# Altium schematic sheet Sheet1.SchDoc
size A4
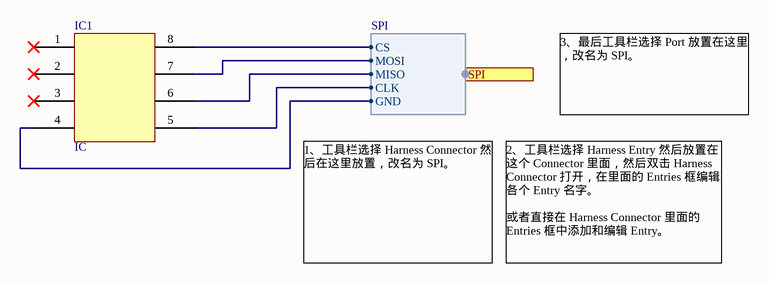
[diagram p0: Sheet1.SchDoc]

## Parts
IC1  IC  [SOP8_N]

## Ports
SPI (harness SPI)

## Harnesses
SPI: CS, MOSI, MISO, CLK, GND

## Nets
NetIC1_4: IC1.4 ; port SPI.GND
NetIC1_5: IC1.5 ; port SPI.CLK
NetIC1_6: IC1.6 ; port SPI.MISO
NetIC1_7: IC1.7 ; port SPI.MOSI
NetIC1_8: IC1.8 ; port SPI.CS

Not connected (* = marked no-connect by the designer): IC1 1* 2* 3*

## Notes on the sheet
- 3、最后工具栏选择 Port 放置在这里，改名为 SPI。
- 1、工具栏选择 Harness Connector 然后在这里放置，改名为 SPI。
- 2、工具栏选择 Harness Entry 然后放置在这个 Connector 里面，然后双击 Harness Connector 打开，在里面的 Entries 框编辑各个 Entry 名字。
  或者直接在 Harness Connector 里面的 Entries 框中添加和编辑 Entry。

## Library data of the parts
IC1 = 8